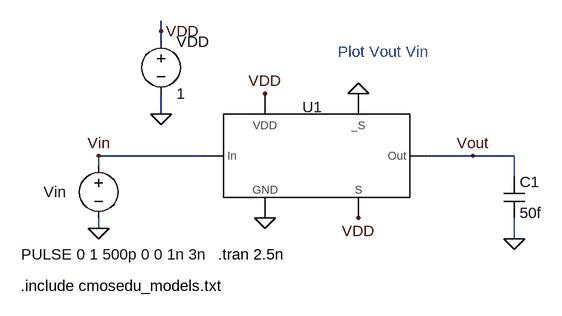
[diagram p0: schematic Fig10_20_symbol.asc]
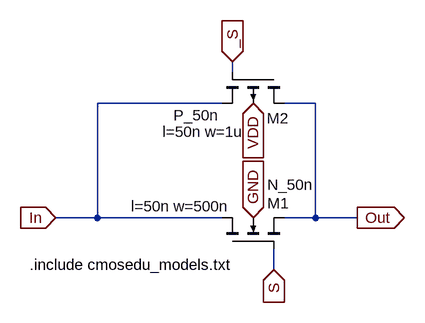
[diagram p1: sub-circuit tg_20_10.asc]
Fig10_20_symbol.asc, the LTspice schematic file:
Version 4
SHEET 1 1136 680
WIRE 304 -304 304 -320
WIRE 304 -288 304 -304
WIRE 304 -176 304 -208
WIRE 368 -112 208 -112
WIRE 784 -112 720 -112
WIRE 848 -112 784 -112
WIRE 208 -96 208 -112
WIRE 848 -80 848 -112
WIRE 208 0 208 -16
WIRE 848 16 848 -16
FLAG 208 0 0
FLAG 848 16 0
FLAG 784 -112 Vout
FLAG 208 -112 Vin
FLAG 304 -176 0
FLAG 304 -304 VDD
FLAG 464 -208 VDD
FLAG 608 -16 VDD
FLAG 464 -16 0
FLAG 608 -208 0
SYMBOL voltage 208 -112 R0
WINDOW 0 -85 56 Left 0
WINDOW 3 -119 152 Left 0
WINDOW 123 0 0 Left 0
WINDOW 39 0 0 Left 0
SYMATTR InstName Vin
SYMATTR Value PULSE 0 1 500p 0 0 1n 3n
SYMBOL cap 832 -80 R0
SYMATTR InstName C1
SYMATTR Value 50f
SYMBOL voltage 304 -304 R0
WINDOW 123 0 0 Left 0
WINDOW 39 0 0 Left 0
SYMATTR InstName VDD
SYMATTR Value 1
SYMBOL TG_20_10 320 -112 R0
SYMATTR InstName U1
TEXT 392 40 Left 0 !.tran 2.5n
TEXT 88 88 Left 0 !.include cmosedu_models.txt
TEXT 576 -272 Left 0 ;Plot Vout Vin

tg_20_10.asc, the sub-circuit schematic file:
Version 4
SHEET 1 1136 680
WIRE 400 -336 400 -352
WIRE 384 -288 192 -288
WIRE 528 -288 480 -288
WIRE 192 -112 192 -288
WIRE 192 -112 128 -112
WIRE 384 -112 192 -112
WIRE 528 -112 528 -288
WIRE 528 -112 480 -112
WIRE 592 -112 528 -112
WIRE 464 -32 464 -64
FLAG 128 -112 In
IOPIN 128 -112 In
FLAG 592 -112 Out
IOPIN 592 -112 Out
FLAG 400 -352 _S
IOPIN 400 -352 In
FLAG 464 -32 S
IOPIN 464 -32 In
FLAG 432 -288 VDD
IOPIN 432 -288 In
FLAG 432 -112 GND
IOPIN 432 -112 In
SYMBOL nmos4 384 -64 R270
WINDOW 0 70 70 VRight 0
WINDOW 3 99 70 VRight 0
WINDOW 123 66 -140 VRight 0
SYMATTR InstName M1
SYMATTR Value N_50n
SYMATTR Value2 l=50n w=500n
SYMBOL pmos4 480 -336 R90
WINDOW 0 71 -7 VRight 0
WINDOW 3 66 101 VRight 0
WINDOW 123 92 62 VRight 0
SYMATTR InstName M2
SYMATTR Value P_50n
SYMATTR Value2 l=50n w=1u
TEXT 88 -40 Left 0 !.include cmosedu_models.txt

The netlist it stands for:
* Fig10_20_symbol.asc
Vin Vin 0 PULSE 0 1 500p 0 0 1n 3n
C1 Vout 0 50f
VDD VDD 0 1
XU1 Vin Vout VDD 0 VDD 0 tg_20_10

* block symbol definitions
.subckt tg_20_10 In Out S _S VDD GND
M1 In S Out GND N_50n l=50n w=500n
M2 Out _S In VDD P_50n l=50n w=1u
.include cmosedu_models.txt
.ends tg_20_10

.model NMOS NMOS
.model PMOS PMOS
.lib standard.mos
.tran 2.5n
.include cmosedu_models.txt
* Plot Vout Vin
.backanno
.end